# Altium schematic sheet TopLevel.SchDoc
size A4; SheetNumber: 1; SheetTotal: 3
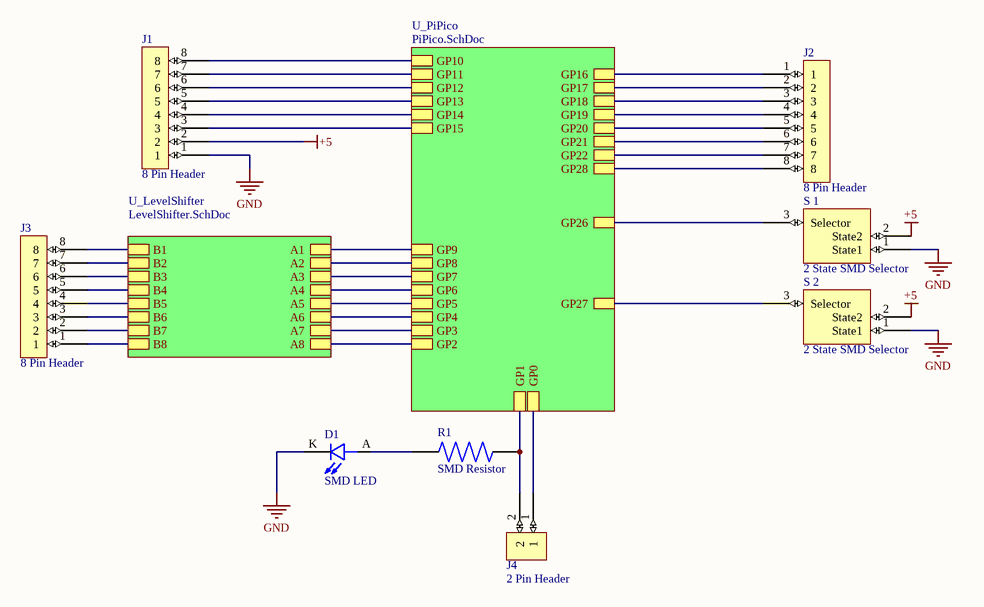
[diagram p0: TopLevel.SchDoc]

## Parts
D1  SMD LED  [SMD LED-Footprint-1]
J1  8 Pin Header  [8 Pin Header-Footprint-1]
J2  8 Pin Header  [8 Pin Header-Footprint-1]
J3  8 Pin Header  [8 Pin Header-Footprint-1]
J4  2 Pin Header  [2 Pin Header-Footprint-1]
R1  SMD Resistor  [SMD Resistor-Footprint-1]
S_1  2 State SMD Selector  [2 State SMD Selector-Footprint-1]
S_2  2 State SMD Selector  [2 State SMD Selector-Footprint-1]

## Sub-sheets
U_LevelShifter = LevelShifter.SchDoc: A1, A2, A3, A4, B1, B2, B3, B4, A5, A6, A7, A8, B5, B6, B7, B8
U_PiPico = PiPico.SchDoc: GP0, GP1, GP2, GP3, GP4, GP5, GP6, GP7, GP8, GP9, GP10, GP11, GP12, GP13, GP14, GP15, GP16, GP17, GP18, GP19, GP20, GP21, GP22, GP26, GP27, GP28

## Nets
+5: J1.2 S_1.2(State2) S_2.2(State2)
GND: D1.K(C) J1.1 S_1.1(State1) S_2.1(State1)
NetD1_A: D1.A R1.1
NetJ1_3: J1.3 ; sheet U_PiPico/GP15
NetJ1_4: J1.4 ; sheet U_PiPico/GP14
NetJ1_5: J1.5 ; sheet U_PiPico/GP13
NetJ1_6: J1.6 ; sheet U_PiPico/GP12
NetJ1_7: J1.7 ; sheet U_PiPico/GP11
NetJ1_8: J1.8 ; sheet U_PiPico/GP10
NetJ2_1: J2.1 ; sheet U_PiPico/GP16
NetJ2_2: J2.2 ; sheet U_PiPico/GP17
NetJ2_3: J2.3 ; sheet U_PiPico/GP18
NetJ2_4: J2.4 ; sheet U_PiPico/GP19
NetJ2_5: J2.5 ; sheet U_PiPico/GP20
NetJ2_6: J2.6 ; sheet U_PiPico/GP21
NetJ2_7: J2.7 ; sheet U_PiPico/GP22
NetJ2_8: J2.8 ; sheet U_PiPico/GP28
NetJ3_1: J3.1 ; sheet U_LevelShifter/B8
NetJ3_2: J3.2 ; sheet U_LevelShifter/B7
NetJ3_3: J3.3 ; sheet U_LevelShifter/B6
NetJ3_4: J3.4 ; sheet U_LevelShifter/B5
NetJ3_5: J3.5 ; sheet U_LevelShifter/B4
NetJ3_6: J3.6 ; sheet U_LevelShifter/B3
NetJ3_7: J3.7 ; sheet U_LevelShifter/B2
NetJ3_8: J3.8 ; sheet U_LevelShifter/B1
NetJ4_1: J4.1 ; sheet U_PiPico/GP0
NetJ4_2: J4.2 R1.2 ; sheet U_PiPico/GP1
NetS_1_3: S_1.3(Selector) ; sheet U_PiPico/GP26
NetS_2_3: S_2.3(Selector) ; sheet U_PiPico/GP27
(unnamed): sheet U_PiPico/GP2, sheet U_LevelShifter/A8
(unnamed): sheet U_PiPico/GP3, sheet U_LevelShifter/A7
(unnamed): sheet U_PiPico/GP4, sheet U_LevelShifter/A6
(unnamed): sheet U_PiPico/GP5, sheet U_LevelShifter/A5
(unnamed): sheet U_PiPico/GP6, sheet U_LevelShifter/A4
(unnamed): sheet U_PiPico/GP7, sheet U_LevelShifter/A3
(unnamed): sheet U_PiPico/GP8, sheet U_LevelShifter/A2
(unnamed): sheet U_PiPico/GP9, sheet U_LevelShifter/A1

## Library data of the parts
D1 = CMP-00018-3: Generic SMD LED
J1-J3 = CMP-00039-1: 8 Pin Breakout Header
J4 = CMP-00041-1: 2Pin  Breakout Header
R1 = CMP-00019-2: Generic SMD Resistor
S_1 S_2 = CMP-00040-1: This is a SMD Pin Soldering Selector